# EAGLE schematic SMDStencil (EAGLE 7.6.0)
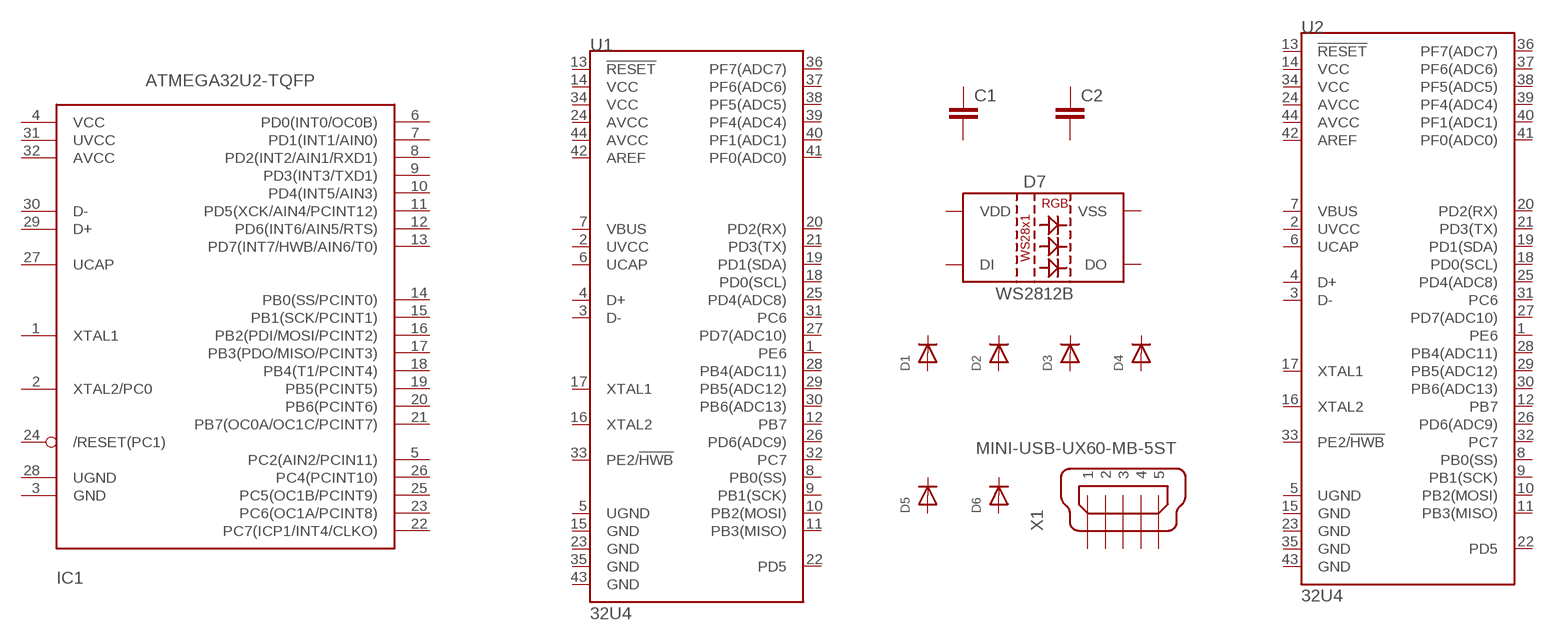
[diagram p0: schematic, sheet 1]

## Parts
C1  C-EUC0805  [C0805]
C2  C-EUC0805K  [C0805K]
D1  DIODESMA  [SMADIODE]
D2  DIODESOD-123  [SOD-123]
D3  DIODESOD-323F  [SOD-323F]
D4  DIODESOD-523  [SOD-523]
D5  DIODESOT23_REFLOW  [SOT23-R]
D6  DIODESOT23_WAVE  [SOT23-W]
D7  WS2812B  [WS2812B]
IC1  ATMEGA32U2-TQFP  [TQFP32-08]
U1  32U4  ATMEGA32U4TQFP-44  [TQFP44]
U2  32U4  ATMEGA32U4_NOARDQFN  [QFN-44]
X1  MINI-USB-UX60-MB-5ST  [UX60-MB-5ST]
Unconnected: C1.1 C1.2 C2.1 C2.2 D1.A D1.C D2.A D2.C D3.A D3.C D4.A D4.K(C) D5.1(A) D5.3(C) D6.1(A) D6.3(C) D7.1(VDD) D7.2(DO) D7.3(VSS) D7.4(DI) IC1.1(XTAL1) IC1.2(XTAL2/PC0) IC1.3(GND) IC1.4(VCC) IC1.5(PC2(AIN2/PCIN11)) IC1.6(PD0(INT0/OC0B)) IC1.7(PD1(INT1/AIN0)) IC1.8(PD2(INT2/AIN1/RXD1)) IC1.9(PD3(INT3/TXD1)) IC1.10(PD4(INT5/AIN3)) IC1.11(PD5(XCK/AIN4/PCINT12)) IC1.12(PD6(INT6/AIN5/RTS)) IC1.13(PD7(INT7/HWB/AIN6/T0)) IC1.14(PB0(SS/PCINT0)) IC1.15(PB1(SCK/PCINT1)) IC1.16(PB2(PDI/MOSI/PCINT2)) IC1.17(PB3(PDO/MISO/PCINT3)) IC1.18(PB4(T1/PCINT4)) IC1.19(PB5(PCINT5)) IC1.20(PB6(PCINT6)) IC1.21(PB7(OC0A/OC1C/PCINT7)) IC1.22(PC7(ICP1/INT4/CLKO)) IC1.23(PC6(OC1A/PCINT8)) IC1.24(/RESET(PC1)) IC1.25(PC5(OC1B/PCINT9)) IC1.26(PC4(PCINT10)) IC1.27(UCAP) IC1.28(UGND) IC1.29(D+) IC1.30(D-) IC1.31(UVCC) IC1.32(AVCC) U1.1(PE6) U1.2(UVCC) U1.3(D-) U1.4(D+) U1.5(UGND) U1.6(UCAP) U1.7(VBUS) U1.8(PB0(SS)) U1.9(PB1(SCK)) U1.10(PB2(MOSI)) U1.11(PB3(MISO)) U1.12(PB7) U1.13(!RESET) U1.14(VCC) U1.15(GND) U1.16(XTAL2) U1.17(XTAL1) U1.18(PD0(SCL)) U1.19(PD1(SDA)) U1.20(PD2(RX)) U1.21(PD3(TX)) U1.22(PD5) U1.23(GND) U1.24(AVCC) U1.25(PD4(ADC8)) U1.26(PD6(ADC9)) U1.27(PD7(ADC10)) U1.28(PB4(ADC11)) U1.29(PB5(ADC12)) U1.30(PB6(ADC13)) U1.31(PC6) U1.32(PC7) U1.33(PE2/!HWB) U1.34(VCC) U1.35(GND) U1.36(PF7(ADC7)) U1.37(PF6(ADC6)) U1.38(PF5(ADC5)) U1.39(PF4(ADC4)) U1.40(PF1(ADC1)) U1.41(PF0(ADC0)) U1.42(AREF) U1.43(GND) U1.44(AVCC) U2.1(PE6) U2.2(UVCC) U2.3(D-) U2.4(D+) U2.5(UGND) U2.6(UCAP) U2.7(VBUS) U2.8(PB0(SS)) U2.9(PB1(SCK)) U2.10(PB2(MOSI)) U2.11(PB3(MISO)) U2.12(PB7) U2.13(!RESET) U2.14(VCC) U2.15(GND) U2.16(XTAL2) U2.17(XTAL1) U2.18(PD0(SCL)) U2.19(PD1(SDA)) U2.20(PD2(RX)) U2.21(PD3(TX)) U2.22(PD5) U2.23(GND) U2.24(AVCC) U2.25(PD4(ADC8)) U2.26(PD6(ADC9)) U2.27(PD7(ADC10)) U2.28(PB4(ADC11)) U2.29(PB5(ADC12)) U2.30(PB6(ADC13)) U2.31(PC6) U2.32(PC7) U2.33(PE2/!HWB) U2.34(VCC) U2.35(GND) U2.36(PF7(ADC7)) U2.37(PF6(ADC6)) U2.38(PF5(ADC5)) U2.39(PF4(ADC4)) U2.40(PF1(ADC1)) U2.41(PF0(ADC0)) U2.42(AREF) U2.43(GND) U2.44(AVCC) X1.1 X1.2 X1.3 X1.4 X1.5

## Library data of the parts
C1 C2 = rcl:C-EU: CAPACITOR, European symbol
D1-D6 = adafruit:DIODE: Diode SMADIODE - SMA Surface Mount Package 20V 1A Schottky Diode Digikey: 641-1014-6-ND DO-1N4148 - Through Hole Small Current Diode SOD-123 20V 1 A (.5mV Vf) Schottky Diode - Digikey: MBRX120TPMSCT-ND SOD-323 10V 570mA (.38mV Vf, 3ns) Schottky Diode - Digikey: ZLLS410CT-ND SOD-523 30V 30mA Schottky Diode (RB751S-40TE61) - Digikey: RB751S-40TE61CT-ND SOT23-R/W - SOT23 Package (R = Solder Paste/Reflow Ovens, W = Hand-Soldering) BAT54Film 40V 300mA - Digikey: 497-7162-1-ND
D7 = SparkFun-LED:WS2812B: WS2812B SMD addressable RGB LED 5x5mm SMD LED with built-in controller IC. Color: Red/Green/Blue mC Rating: RGB: 390, 660, 180 mcd Forward Voltage: RGB: 2.0, 3.0, 3.0 V Packages:WS2812B SparkFun Products: Blynk Board - ESP8266 <https://www.sparkfun.com/products/13794>; PROD_ID: DIO-12503
IC1 = adafruit:ATMEGA32U2: ATmega32u2 Pin compatible with the atmega8u2, atmega16u2 and atmega32u2 8, 16 or 32 K flash, 1K RAM, 512b EEPROM 8 bit and 16 bit timer (5 PWM total) UART, SPI (no I2C!) USB with 4 endpoints, LUFA compatible 22 I/O lines, analog comparator (no ADC!) Comes with DFU bootloader burned in!
U1 = SparkFun-IC-Microcontroller:ATMEGA32U4: Atmel MCU, 32KByte Atmel 44-pin 8-bit Microcontroller with 32KBytes of ISP Flash and USB Controller Datasheet <http://cdn.sparkfun.com/datasheets/Dev/Arduino/Boards/ATMega32U4.pdf> SparkFun Products LilyPad Arduino USB - ATmega32U4 Board <https://www.sparkfun.com/products/12049> (DEV-12049) Pro Micro - 5V/16MHz <https://www.sparkfun.com/products/12640> (DEV-12640) Pro Micro - 3.3V/8MHz <https://www.sparkfun.com/products/12587> (DEV-12587) Fio v3 - ATmega32U4 <https://www.sparkfun.com/products/11520> (DEV-11520) Qduino Mini <https://www.sparkfun.com/products/13614> (DEV-13614) Makey Makey - Standard Kit <https://www.sparkfun.com/products/11511> (WIG-11511) Makey Makey Deluxe Kit <https://www.sparkfun.com/products/11519> (WIG-11519); PROD_ID: IC-11161
U2 = SparkFun-IC-Microcontroller:ATMEGA32U4_NOARD: Atmel MCU, 32KByte Atmel 44-pin 8-bit Microcontroller with 32KBytes of ISP Flash and USB Controller Datasheet <http://cdn.sparkfun.com/datasheets/Dev/Arduino/Boards/ATMega32U4.pdf> SparkFun Products LilyPad Arduino USB - ATmega32U4 Board <https://www.sparkfun.com/products/12049> (DEV-12049) Pro Micro - 5V/16MHz <https://www.sparkfun.com/products/12640> (DEV-12640) Pro Micro - 3.3V/8MHz <https://www.sparkfun.com/products/12587> (DEV-12587) Fio v3 - ATmega32U4 <https://www.sparkfun.com/products/11520> (DEV-11520) Qduino Mini <https://www.sparkfun.com/products/13614> (DEV-13614) Makey Makey - Standard Kit <https://www.sparkfun.com/products/11511> (WIG-11511) Makey Makey Deluxe Kit <https://www.sparkfun.com/products/11519> (WIG-11519); PROD_ID: IC-10828
X1 = con-hirose:MINI-USB-: MINI USB Connector Source: http://www.hirose.co.jp/cataloge_hp/e24000019.pdf; OC_FARNELL: unknown; OC_NEWARK: unknown